# EAGLE schematic esp_multi_sense (EAGLE 9.3.0)
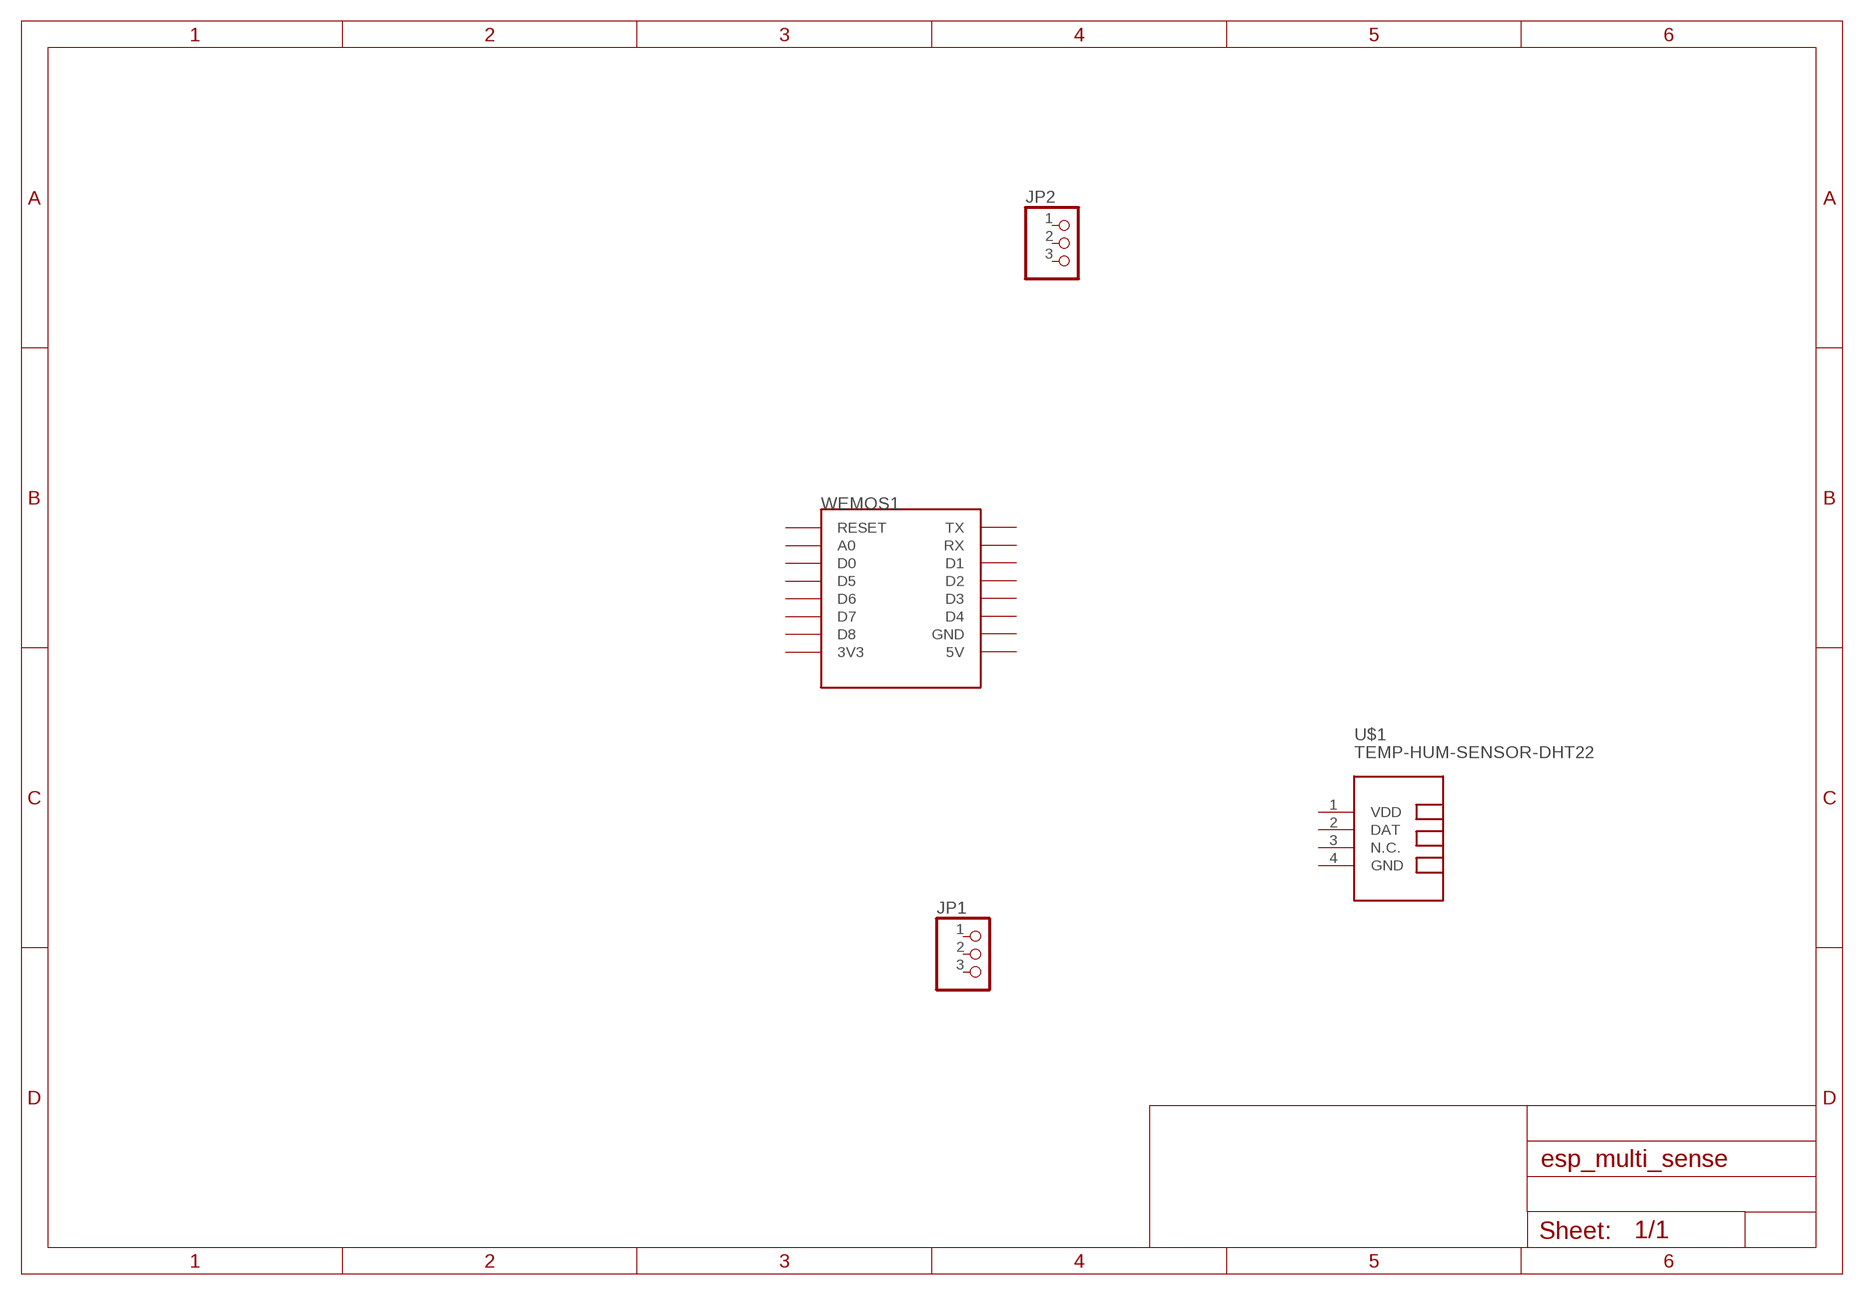
[diagram p0: schematic, sheet 1]

## Parts
JP1  PINHD-1X3/90  [1X03/90]
JP2  PINHD-1X3  [1X03]
U$1  TEMP-HUM-SENSOR-DHT22  [TEMP-HUM-SENSOR-DHT22]
WEMOS1  WEMOS-D1-MINI  [WEMOS-D1-MINI]
Unconnected: JP1.1 JP1.2 JP1.3 JP2.1 JP2.2 JP2.3 U$1.2(DAT) U$1.3(N.C.) WEMOS1.3V3 WEMOS1.5V WEMOS1.A0 WEMOS1.D0 WEMOS1.D1 WEMOS1.D2 WEMOS1.D3 WEMOS1.D4 WEMOS1.D5 WEMOS1.D6 WEMOS1.D7 WEMOS1.D8 WEMOS1.GND WEMOS1.RESET WEMOS1.RX WEMOS1.TX

## Power pins joined to a net without a drawn wire
GND: U$1.4(GND)
VDD: U$1.1(VDD)

## Library data of the parts
JP1 JP2 = pinhead:PINHD-1X3: PIN HEADER
U$1 = SWI_COMMONS:TEMP-HUM-SENSOR-DHT22: DHT22 - digital humidity & temperature sensor Also known as: AM2302 AM2302 datasheet available here: http://akizukidenshi.com/download/ds/aosong/AM2302.pdf Click here to find device on ebay.com <http://www.ebay.com/sch/dht22+digital+sensor>
WEMOS1 = SWI_COMMONS:WEMOS-D1-MINI: WeMos.cc D1 mini ESP8266 module